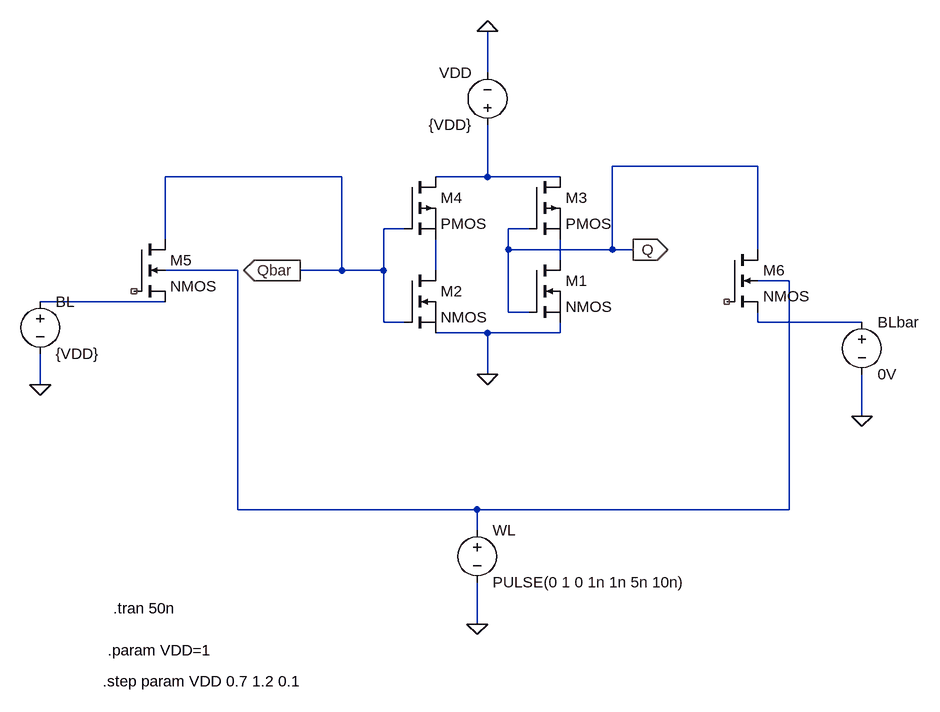
[diagram p0: schematic SRAM voltage analysis.asc]
SRAM voltage analysis.asc, the LTspice schematic file:
Version 4.1
SHEET 1 1008 680
WIRE 336 -416 336 -480
WIRE 752 -272 528 -272
WIRE 112 -256 -160 -256
WIRE 336 -256 336 -336
WIRE 336 -256 256 -256
WIRE 448 -256 336 -256
WIRE 208 -176 176 -176
WIRE 400 -176 368 -176
WIRE -160 -160 -160 -256
WIRE 368 -144 368 -176
WIRE 528 -144 528 -272
WIRE 528 -144 368 -144
WIRE 560 -144 528 -144
WIRE 752 -144 752 -272
WIRE 448 -128 448 -160
WIRE -48 -112 -160 -112
WIRE 112 -112 112 -256
WIRE 112 -112 48 -112
WIRE 176 -112 176 -176
WIRE 176 -112 112 -112
WIRE 256 -112 256 -160
WIRE 800 -96 752 -96
WIRE -160 -64 -352 -64
WIRE 368 -48 368 -144
WIRE 400 -48 368 -48
WIRE 176 -32 176 -112
WIRE 208 -32 176 -32
WIRE 752 -32 752 -48
WIRE 912 -32 752 -32
WIRE 336 -16 256 -16
WIRE 448 -16 448 -32
WIRE 448 -16 336 -16
WIRE 336 48 336 -16
WIRE -352 64 -352 16
WIRE 912 112 912 48
WIRE -48 256 -48 -112
WIRE 320 256 -48 256
WIRE 800 256 800 -96
WIRE 800 256 320 256
WIRE 320 288 320 256
WIRE 320 432 320 368
FLAG 336 -480 0
FLAG 336 48 0
FLAG 560 -144 Q
IOPIN 560 -144 Out
FLAG 48 -112 Qbar
IOPIN 48 -112 Out
FLAG -352 64 0
FLAG 912 112 0
FLAG 320 432 0
SYMBOL nmos 400 -128 R0
SYMATTR InstName M1
SYMBOL nmos 208 -112 R0
SYMATTR InstName M2
SYMBOL pmos 400 -256 R0
SYMATTR InstName M3
SYMBOL pmos 208 -256 R0
SYMATTR InstName M4
SYMBOL voltage 336 -320 R180
WINDOW 0 24 96 Left 2
WINDOW 3 24 16 Left 2
WINDOW 123 0 0 Left 0
WINDOW 39 0 0 Left 0
SYMATTR InstName VDD
SYMATTR Value {VDD}
SYMBOL voltage -352 -80 R0
WINDOW 123 0 0 Left 0
WINDOW 39 0 0 Left 0
SYMATTR InstName BL
SYMATTR Value {VDD}
SYMBOL voltage 912 -48 R0
WINDOW 123 0 0 Left 0
WINDOW 39 0 0 Left 0
SYMATTR InstName BLbar
SYMATTR Value 0V
SYMBOL voltage 320 272 R0
WINDOW 123 0 0 Left 0
WINDOW 39 0 0 Left 0
SYMATTR InstName WL
SYMATTR Value PULSE(0 1 0 1n 1n 5n 10n)
SYMBOL nmos4 -208 -160 R0
SYMATTR InstName M5
SYMBOL nmos4 704 -144 R0
SYMATTR InstName M6
TEXT -240 408 Left 2 !.tran 50n
TEXT -248 472 Left 2 !.param VDD=1
TEXT -256 520 Left 2 !.step param VDD 0.7 1.2 0.1

The netlist it stands for:
* SRAM voltage analysis.asc
M1 N002 Q 0 0 NMOS
M2 N004 Qbar 0 0 NMOS
M3 N001 Q N002 N002 PMOS
M4 N001 Qbar N004 N004 PMOS
VDD N001 0 {VDD}
V§BL N005 0 {VDD}
V§BLbar N006 0 0V
V§WL N003 0 PULSE(0 1 0 1n 1n 5n 10n)
M5 Qbar NC_01 N005 N003 NMOS
M6 Q NC_02 N006 N003 NMOS
.model NMOS NMOS
.model PMOS PMOS
.lib standard.mos
.tran 50n
.param VDD=1
.step param VDD 0.7 1.2 0.1
.backanno
.end